# Altium schematic sheet Power.SchDoc
size A; DocumentNumber: 5; SheetNumber: 5; SheetTotal: 5
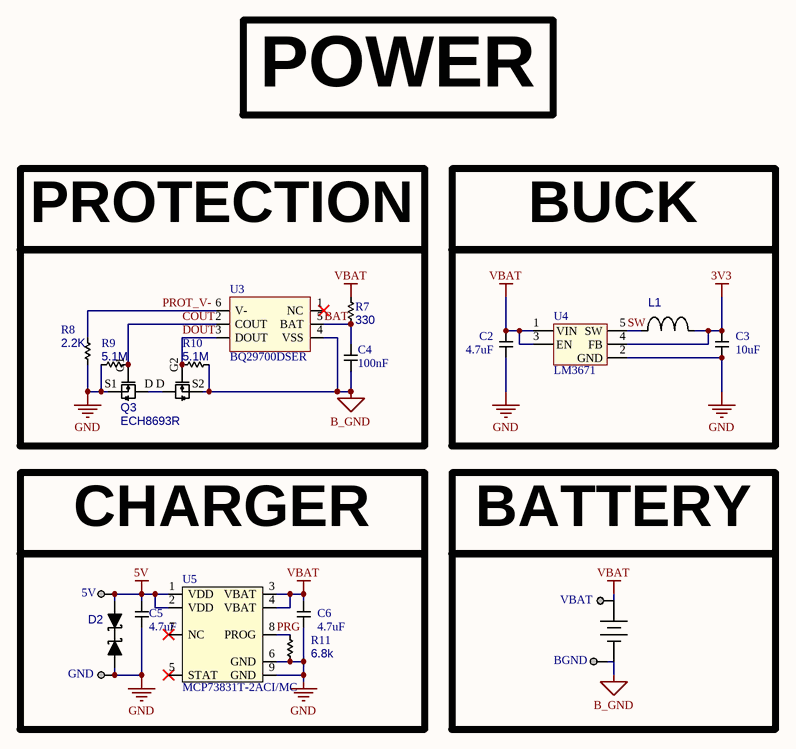
[diagram p0: Power.SchDoc]

## Parts
5V  0.1" Header  [0.1" Header]  (value not drawn)  (no BOM)
BGND  0.1" Header  [0.1" Header]  (value not drawn)  (no BOM)
C2  4.7uF  [CAP_0402_HIGH]
C3  10uF  [CAP_0402_HIGH]
C4  100nF  [CAP_0402_HIGH]
C5  4.7uF  [CAP_0402_HIGH]
C6  4.7uF  [CAP_0402_HIGH]
D2  D5V0L1B2LP4-7B  [D5V0L1B2LP4-7B]  (value not drawn)
GND  0.1" Header  [0.1" Header]  (value not drawn)  (no BOM)
L1  CIGT201610EH2R2MNE  [CIGT201610EH2R2MNE]  (value not drawn)
Q3  ECH8693R  [ECH8693R]
R7  330  [RES_0402_HIGH]
R8  2.2K  [RES_0402_HIGH]
R9  5.1M  [RES_0402_HIGH]
R10  5.1M  [RES_0402_HIGH]
R11  6.8k  [RES_0402_HIGH]
U3  BQ29700DSER  [BQ29700DSER]
U4  LM3671  [LM3671-BGA]
U5  MCP73831T-2ACI/MC  [MCP73831T-2ACI/MC]
VBAT  0.1" Header  [0.1" Header]  (value not drawn)  (no BOM)

## Nets
3V3: C3.2 L1.2 U4.4(FB)
5V: 5V.1 C5.2 D2.1 U5.1(VDD) U5.2(VDD)
B_GND: BGND.1 C4.1 Q3.S2(S) R10.1 U3.4(VSS)
GND: C2.1 C3.1 C5.1 C6.1 D2.2 GND.1 Q3.S1(S) R8.1 R9.2 R11.2 U4.2(GND) U5.6(GND) U5.9(GND)
VBAT: C2.2 C6.2 R7.1 U4.1(VIN) U4.3(EN) U5.3(VBAT) U5.4(VBAT) VBAT.1
BAT: C4.2 R7.2 U3.5(BAT)
COUT: Q3.G1(G) R9.1 U3.2(COUT)
DOUT: Q3.G2(G) R10.2 U3.3(DOUT)
PRG: R11.1 U5.8(PROG)
PROT_V-: R8.2 U3.6(V-)
SW: L1.1 U4.5(SW)

Not connected (* = marked no-connect by the designer): Q3 D; U3 1(NC)*; U5 5(STAT)* 7(NC)*

## Notes on the sheet
- POWER
- PROTECTION
- BUCK
- CHARGER
- (near VBAT) BATTERY

## Library data of the parts
C2-C6 = Capacitor_0402: 0402 Capacitor
D2 = D5V0L1B2LP4-7B: D5V0L1B2LP4-7B 14V Clamp 6A (8/20µs) Ipp Tvs Diode Surface Mount X2-DFN1006-2
L1 = CIGT201610EH2R2MNE: CIGT201610EH2R2MNE 2.2µH Unshielded Thin Film Inductor 2.5A 87mOhm Max 0806 (2016 Metric)
Q3 = ECH8693R: Mosfet Array 2 N-Channel (Dual) Common Drain 24V 14A 1.4W Surface Mount SOT-28FL/ECH8
R7-R11 = Resistor_0402: 0402 Resistor
U3 = BQ29700DSER: Battery Battery Protection IC Lithium-Ion/Polymer 6-WSON (1.5x1.5)
U4 = LM3671: LM3671 IC REG BUCK 3.3V 0.6A SYNC 5USMD
U5 = MCP73831T-2ACI/MC: MCP73831T-2ACI/MC Charger IC Lithium-Ion/Polymer